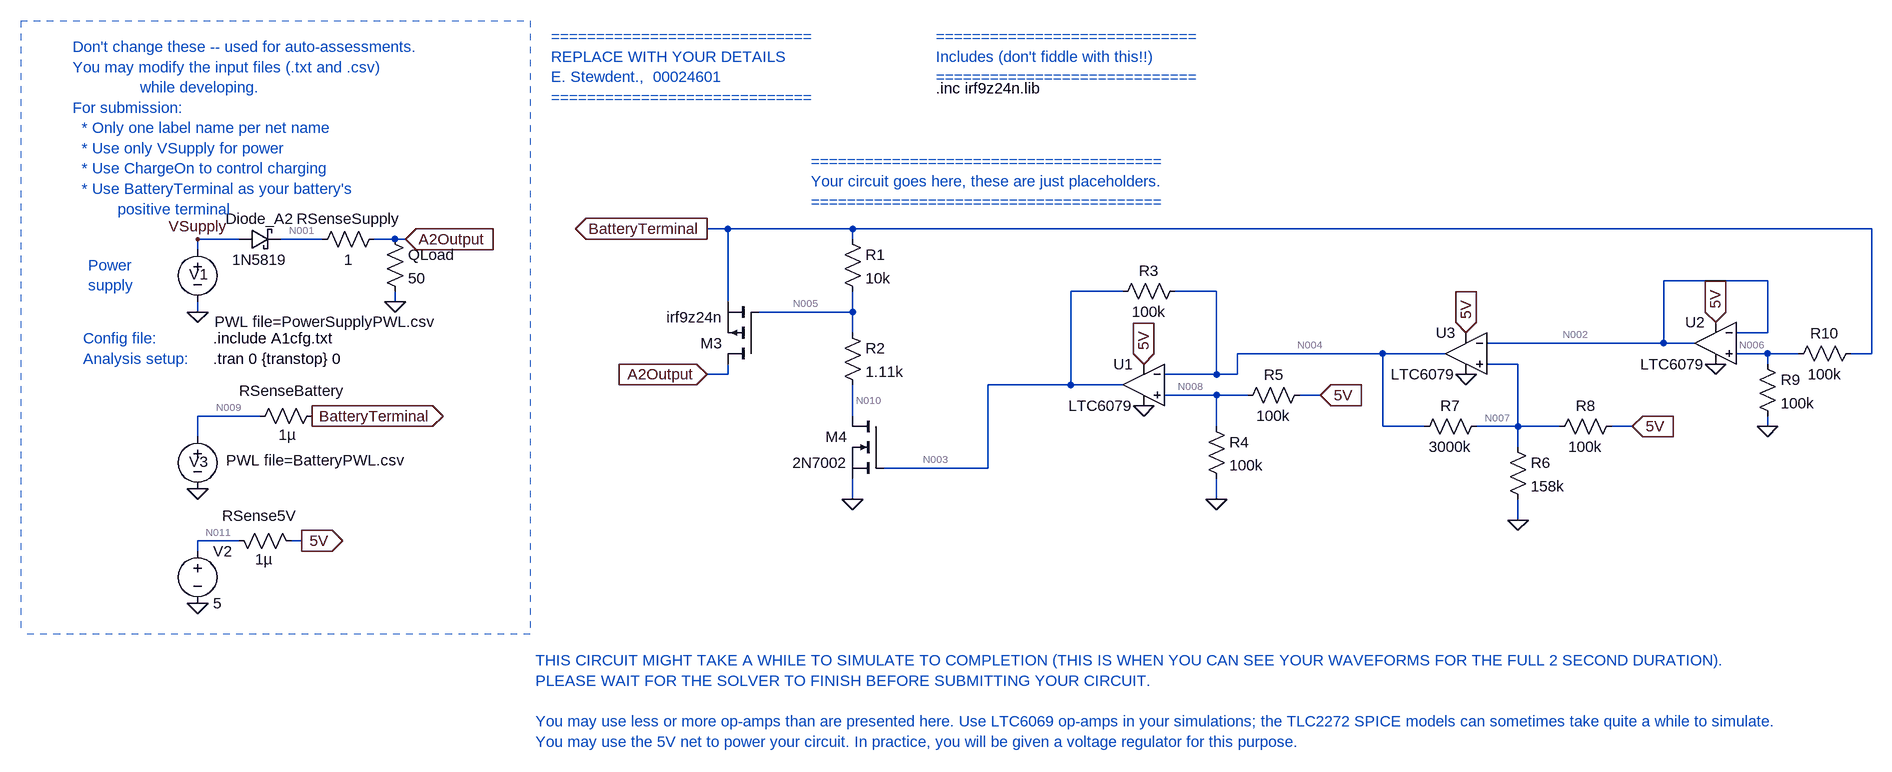
[diagram p0: schematic E344_19872887_A3.asc]
E344_19872887_A3.asc, the LTspice schematic file:
Version 4
SHEET 1 1824 680
WIRE -1280 -1104 -1312 -1104
WIRE -1088 -1104 -1280 -1104
WIRE 480 -1104 -1088 -1104
WIRE -2032 -1088 -2096 -1088
WIRE -1904 -1088 -1968 -1088
WIRE -1792 -1088 -1824 -1088
WIRE -1776 -1088 -1792 -1088
WIRE -1088 -1088 -1088 -1104
WIRE -2096 -1072 -2096 -1088
WIRE 320 -1024 160 -1024
WIRE -672 -1008 -752 -1008
WIRE -528 -1008 -592 -1008
WIRE -1792 -992 -1792 -1008
WIRE -1280 -992 -1280 -1104
WIRE -2096 -976 -2096 -992
WIRE -1088 -976 -1088 -1008
WIRE -1088 -976 -1232 -976
WIRE -1088 -944 -1088 -976
WIRE 320 -944 320 -1024
WIRE 320 -944 272 -944
WIRE 160 -928 160 -1024
WIRE 160 -928 -112 -928
WIRE 208 -928 160 -928
WIRE -272 -912 -496 -912
WIRE -176 -912 -272 -912
WIRE 320 -912 272 -912
WIRE 368 -912 320 -912
WIRE 480 -912 480 -1104
WIRE 480 -912 448 -912
WIRE -64 -896 -112 -896
WIRE 320 -896 320 -912
WIRE -1280 -880 -1280 -896
WIRE -1280 -880 -1312 -880
WIRE -528 -880 -528 -1008
WIRE -528 -880 -608 -880
WIRE -496 -880 -496 -912
WIRE -496 -880 -528 -880
WIRE -752 -864 -752 -1008
WIRE -752 -864 -880 -864
WIRE -672 -864 -752 -864
WIRE -528 -848 -608 -848
WIRE -480 -848 -528 -848
WIRE -368 -848 -400 -848
WIRE -2000 -816 -2096 -816
WIRE -1088 -816 -1088 -864
WIRE -528 -800 -528 -848
WIRE -272 -800 -272 -912
WIRE -208 -800 -272 -800
WIRE -64 -800 -64 -896
WIRE -64 -800 -128 -800
WIRE 0 -800 -64 -800
WIRE 112 -800 80 -800
WIRE 320 -800 320 -816
WIRE -2096 -784 -2096 -816
WIRE -64 -768 -64 -800
WIRE -880 -736 -880 -864
WIRE -880 -736 -1040 -736
WIRE -1088 -688 -1088 -720
WIRE -528 -688 -528 -720
WIRE -64 -656 -64 -688
WIRE -2032 -624 -2096 -624
WIRE -1936 -624 -1952 -624
WIRE -2096 -608 -2096 -624
FLAG -2096 -976 0
FLAG -1776 -1088 A2Output
IOPIN -1776 -1088 In
FLAG -1920 -816 BatteryTerminal
IOPIN -1920 -816 Out
FLAG -2096 -704 0
FLAG -1936 -624 5V
IOPIN -1936 -624 Out
FLAG -2096 -1088 VSupply
FLAG -1792 -992 0
FLAG -2096 -528 0
FLAG -1312 -1104 BatteryTerminal
IOPIN -1312 -1104 Out
FLAG -1312 -880 A2Output
IOPIN -1312 -880 In
FLAG -640 -896 5V
IOPIN -640 -896 In
FLAG -1088 -688 0
FLAG -640 -832 0
FLAG -528 -688 0
FLAG -368 -848 5V
IOPIN -368 -848 In
FLAG 112 -800 5V
IOPIN 112 -800 In
FLAG -144 -944 5V
IOPIN -144 -944 In
FLAG -144 -880 0
FLAG -64 -656 0
FLAG 240 -960 5V
IOPIN 240 -960 In
FLAG 240 -896 0
FLAG 320 -800 0
SYMBOL voltage -2096 -1088 R0
WINDOW 123 0 0 Left 0
WINDOW 39 0 0 Left 0
WINDOW 3 26 127 Left 2
WINDOW 0 -13 54 Left 2
SYMATTR Value PWL file=PowerSupplyPWL.csv
SYMATTR InstName V1
SYMBOL res -1904 -832 R90
WINDOW 0 -7 47 VBottom 2
WINDOW 3 29 54 VTop 2
SYMATTR InstName RSenseBattery
SYMATTR Value 1µ
SYMBOL schottky -2032 -1072 R270
WINDOW 0 32 32 VTop 2
WINDOW 3 0 32 VBottom 2
SYMATTR InstName Diode_A2
SYMATTR Value 1N5819
SYMATTR Description Diode
SYMATTR Type diode
SYMBOL voltage -2096 -800 R0
WINDOW 123 0 0 Left 0
WINDOW 39 0 0 Left 0
WINDOW 3 44 52 Left 2
WINDOW 0 -13 54 Left 2
SYMATTR Value PWL file=BatteryPWL.csv
SYMATTR InstName V3
SYMBOL res -1920 -1072 R270
WINDOW 0 32 56 VTop 2
WINDOW 3 0 56 VBottom 2
SYMATTR InstName RSenseSupply
SYMATTR Value 1
SYMBOL res -1808 -1104 R0
SYMATTR InstName QLoad
SYMATTR Value 50
SYMBOL voltage -2096 -624 R0
WINDOW 123 0 0 Left 0
WINDOW 39 0 0 Left 0
SYMATTR InstName V2
SYMATTR Value 5
SYMBOL res -2048 -640 M90
WINDOW 0 -7 47 VBottom 2
WINDOW 3 29 54 VTop 2
SYMATTR InstName RSense5V
SYMATTR Value 1µ
SYMBOL pmos -1232 -896 R180
SYMATTR InstName M3
SYMATTR Value irf9z24n
SYMATTR Prefix X
SYMATTR SpiceModel irf9z24n
SYMBOL nmos -1040 -816 M0
SYMATTR InstName M4
SYMATTR Value 2N7002
SYMBOL OpAmps\\LTC6079 -640 -864 M0
SYMATTR InstName U1
SYMBOL OpAmps\\LTC6079 240 -928 M0
SYMATTR InstName U2
SYMBOL OpAmps\\LTC6079 -144 -912 M0
SYMATTR InstName U3
SYMBOL res -1104 -1104 R0
SYMATTR InstName R1
SYMATTR Value 10k
SYMBOL res -1104 -960 R0
SYMATTR InstName R2
SYMATTR Value 1.11k
SYMBOL res -576 -1024 R90
WINDOW 0 0 56 VBottom 2
WINDOW 3 32 56 VTop 2
SYMATTR InstName R3
SYMATTR Value 100k
SYMBOL res -544 -816 R0
SYMATTR InstName R4
SYMATTR Value 100k
SYMBOL res -384 -864 R90
WINDOW 0 0 56 VBottom 2
WINDOW 3 32 56 VTop 2
SYMATTR InstName R5
SYMATTR Value 100k
SYMBOL res -80 -784 R0
SYMATTR InstName R6
SYMATTR Value 158k
SYMBOL res -112 -816 R90
WINDOW 0 0 56 VBottom 2
WINDOW 3 32 56 VTop 2
SYMATTR InstName R7
SYMATTR Value 3000k
SYMBOL res 96 -816 R90
WINDOW 0 0 56 VBottom 2
WINDOW 3 32 56 VTop 2
SYMATTR InstName R8
SYMATTR Value 100k
SYMBOL res 304 -912 R0
SYMATTR InstName R9
SYMATTR Value 100k
SYMBOL res 464 -928 R90
WINDOW 0 0 56 VBottom 2
WINDOW 3 32 56 VTop 2
SYMATTR InstName R10
SYMATTR Value 100k
TEXT -2072 -904 Left 2 !.tran 0 {transtop} 0
TEXT -2072 -936 Left 2 !.include A1cfg.txt
TEXT -2288 -1384 Left 2 ;Don't change these -- used for auto-assessments.\nYou may modify the input files (.txt and .csv) \n               while developing.\nFor submission: \n  * Only one label name per net name\n  * Use only VSupply for power\n  * Use ChargeOn to control charging\n  * Use BatteryTerminal as your battery's \n          positive terminal
TEXT -2272 -936 Left 2 ;Config file:
TEXT -2272 -904 Left 2 ;Analysis setup:
TEXT -2264 -1048 Left 2 ;Power\nsupply
TEXT -1552 -1400 Left 2 ;=============================\nREPLACE WITH YOUR DETAILS\nE. Stewdent.,  00024601\n=============================
TEXT -960 -1320 Left 2 !.inc irf9z24n.lib
TEXT -960 -1400 Left 2 ;=============================\nIncludes (don't fiddle with this!!)\n=============================
TEXT -1152 -1208 Left 2 ;=======================================\nYour circuit goes here, these are just placeholders.\n=======================================
TEXT -1576 -440 Left 2 ;THIS CIRCUIT MIGHT TAKE A WHILE TO SIMULATE TO COMPLETION (THIS IS WHEN YOU CAN SEE YOUR WAVEFORMS FOR THE FULL 2 SECOND DURATION).\nPLEASE WAIT FOR THE SOLVER TO FINISH BEFORE SUBMITTING YOUR CIRCUIT.\n \nYou may use less or more op-amps than are presented here. Use LTC6069 op-amps in your simulations; the TLC2272 SPICE models can sometimes take quite a while to simulate.\nYou may use the 5V net to power your circuit. In practice, you will be given a voltage regulator for this purpose.
LINE Normal -1584 -1424 -1584 -480 2
LINE Normal -2368 -1424 -1584 -1424 2
LINE Normal -1584 -480 -2368 -480 2
LINE Normal -1584 -496 -1584 -496 2
LINE Normal -2368 -1424 -2368 -480 2

The netlist it stands for:
* E344_19872887_A3.asc
V1 VSupply 0 PWL file=PowerSupplyPWL.csv
RSenseBattery BatteryTerminal N009 1µ
Diode_A2 VSupply N001 1N5819
V3 N009 0 PWL file=BatteryPWL.csv
RSenseSupply N001 A2Output 1
R§QLoad A2Output 0 50
V2 N011 0 5
RSense5V N011 5V 1µ
XM3 A2Output N005 BatteryTerminal irf9z24n irf9z24n  ; pins D G S
M4 N010 N003 0 0 2N7002
XU1 N008 N004 5V 0 N003 LTC6078  ; LTC6079, pins In+ In- V+ V- OUT
XU2 N006 N002 5V 0 N002 LTC6078  ; LTC6079, pins In+ In- V+ V- OUT
XU3 N007 N002 5V 0 N004 LTC6078  ; LTC6079, pins In+ In- V+ V- OUT
R1 BatteryTerminal N005 10k
R2 N005 N010 1.11k
R3 N004 N003 100k
R4 N008 0 100k
R5 5V N008 100k
R6 N007 0 158k
R7 N007 N004 3000k
R8 5V N007 100k
R9 N006 0 100k
R10 BatteryTerminal N006 100k
.model D D
.lib standard.dio
.model NMOS NMOS
.model PMOS PMOS
.lib standard.mos
.tran 0 {transtop} 0
.include A1cfg.txt
* Don't change these -- used for auto-assessments.
* You may modify the input files (.txt and .csv)
*                while developing.
* For submission:
*   * Only one label name per net name
*   * Use only VSupply for power
*   * Use ChargeOn to control charging
*   * Use BatteryTerminal as your battery's
*           positive terminal
* Config file:
* Analysis setup:
* Power
* supply
* =============================
* REPLACE WITH YOUR DETAILS
* E. Stewdent.,  00024601
* =============================
.inc irf9z24n.lib
* =============================
* Includes (don't fiddle with this!!)
* =============================
* =======================================
* Your circuit goes here, these are just placeholders.
* =======================================
* THIS CIRCUIT MIGHT TAKE A WHILE TO SIMULATE TO COMPLETION (THIS IS WHEN YOU CAN SEE YOUR WAVEFORMS FOR THE FULL 2 SECOND DURATION).
* PLEASE WAIT FOR THE SOLVER TO FINISH BEFORE SUBMITTING YOUR CIRCUIT.
* You may use less or more op-amps than are presented here. Use LTC6069 op-amps in your simulations; the TLC2272 SPICE models can sometimes take quite a while to simulate.
* You may use the 5V net to power your circuit. In practice, you will be given a voltage regulator for this purpose.
.lib LTC5.lib
.backanno
.end

* Results of the author's LTspice run, read from the files saved beside the schematic
* Operating Point, zero values left out:
*   V(vsupply) = 7.4 V
*   V(batteryterminal) = 6.3 V
*   V(n009) = 6.3 V
*   V(n001) = 7.02 V
*   V(a2output) = 6.427 V
*   V(n011) = 5 V
*   V(5v) = 5 V
*   V(n005) = 630.5 mV
*   V(n010) = 1.211 mV
*   V(n003) = 4.998 V
*   V(n008) = 2.5 V
*   V(n004) = 1.347 mV
*   V(n002) = 3.15 V
*   V(n006) = 3.15 V
*   V(n007) = 3.001 V
*   Id(M4) = 566.9 µA
*   Is(M4) = -566.9 µA
*   I(Diode_a2) = 593.7 mA
*   I(R10) = 31.5 µA
*   I(R9) = 31.5 µA
*   I(R8) = 19.99 µA
*   I(R7) = 999.8 nA
*   I(R6) = 18.99 µA
*   I(R5) = 25 µA
*   I(R4) = 25 µA
*   I(R3) = -49.97 µA
*   I(R2) = 566.9 µA
*   I(R1) = 566.9 µA
*   I(Rsense5v) = 223 µA
*   I(Qload) = 128.5 mA
*   I(Rsensesupply) = 593.7 mA
*   I(Rsensebattery) = 464.6 mA
*   I(V2) = -223 µA
*   I(V3) = 464.6 mA
*   I(V1) = -593.7 mA
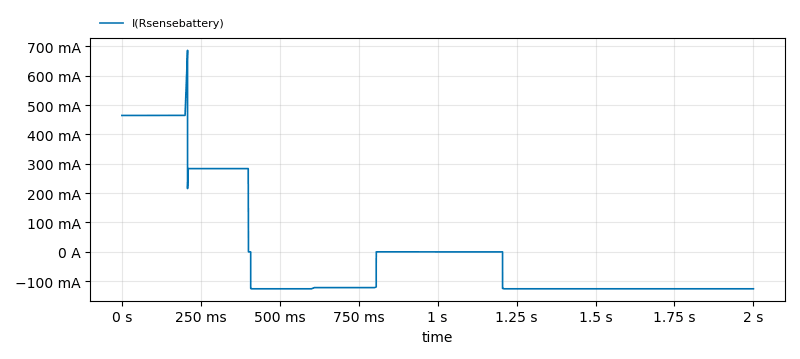
[diagram p1: Transient Analysis of E344_19872887_A3.asc, plotted from the saved traces]
* Transient Analysis, 1 run:
*   I(Rsensebattery): min -125.9 mA, max 686.4 mA, average 1.316 mA, rms 200 mA, last -125.9 mA